# Altium schematic sheet laser.SchDoc: Laser
size A4; Author: Peter Tanner; SheetNumber: 6; SheetTotal: 9; SPICEModelCacheEYCFJCLC: <root> / <DocumentId>EYCFJCLC</DocumentId> / <CacheFrame Number="0"> / <Model Name="si2302cds" Kind="CKT"> / <Text>*August 11, 2008 / *Doc. ID: 68508, S-81826, Rev. A / *File Name: Si2302CDS_PS.txt and Si2302CDS_PS.lib / *This document is intended as a SPICE modeling guideline and does not / *constitute a commercial product data sheet.  Designers should refer to the / *appropriate data sheet of the same number for guaranteed specification / *limits. / .SUBCKT Si2302CDS D G S / M1  3  GX S S NMOS W=273327u L=0.250u / M2  S  GX S D PMOS W=273327u L=0.235u / RG  G  GX     4 / R1  D  3      RTEMP 18E-3 / CGS GX S      201E-12 / DBD S  D      DBD / *********************************************************** / .MODEL  NMOS       NMOS ( LEVEL  = 3        TOX    = 1.7E-8 / + RS     = 18E-3          RD     = 0        NSUB   = 2.45E17 / + KP     = 2.8E-5         UO     = 650 / + VMAX   = 0              XJ     = 5E-7     KAPPA  = 3E-2 / + ETA    = 1E-4           TPG    = 1 / + IS     = 0              LD     = 0 / + CGSO   = 0              CGDO   = 0        CGBO   = 0 / + NFS    = 0.8E12         DELTA  = 0.1) / ************************************************************ / .MODEL  PMOS       PMOS ( LEVEL  = 3        TOX    = 1.7E-8 / +NSUB    = 2E17           IS     = 0        TPG    = -1) / ************************************************************ / .MODEL DBD D (CJO=60E-12 VJ=0.38 M=0.26 / +FC=0.5 TT=4.71E-8 T_MEASURED=25 BV=21 / +RS=4.856e-02 N=1.214 IS=5.289e-09 IKF=1000 / +EG=5.600e-01 XTI=8.258 TRS1=2.944e-12) / ************************************************************ / .MODEL RTEMP RES (TC1=8E-3 TC2=5.5E-6) / ************************************************************ / .ENDS</Text> / </Model> / <Model Name="di_1n5819" Kind="MDL"> / <Text>*SRC=1N5819;DI_1N5819;Diodes;Si;  40.0V  1.00A  3.00us   Diodes Inc. Schottky Barrier Rectifier / .MODEL DI_1N5819 D  ( IS=390n RS=0.115 BV=40.0 IBV=1.00m / + CJO=203p  M=0.333 N=1.70 TT=4.32u )</Text> / </Model> / </CacheFrame> / </root>
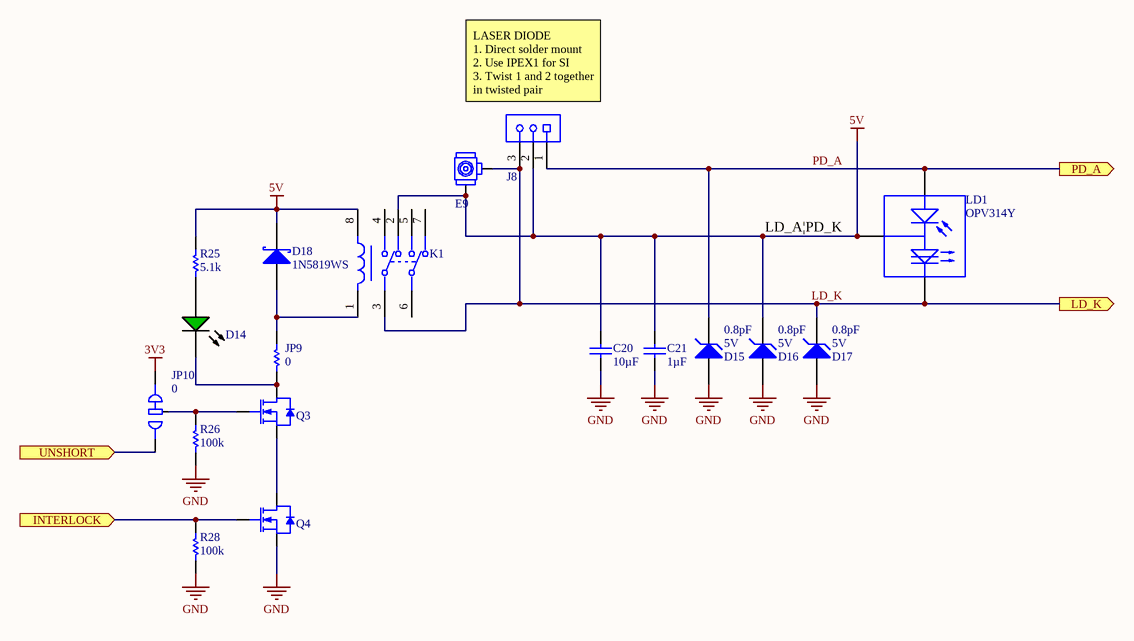
[diagram p0: laser.SchDoc]

## Parts
C20  value 10µF  [CAPC1005X06N]  (hidden comment: CL05A106MQ5NUNC)
C21  value 1µF  [CAPC1005X06N]  (hidden comment: CL05A105KA5NQNC)
D14  KT-0805G  [LED_0805]  (value not drawn)
D15  value 5V  Capacitance: 0.8pF  [DFN60P100X45-2L]  (hidden comment: H5VU10U)
D16  value 5V  Capacitance: 0.8pF  [DFN60P100X45-2L]  (hidden comment: H5VU10U)
D17  value 5V  Capacitance: 0.8pF  [DFN60P100X45-2L]  (hidden comment: H5VU10U)
D18  1N5819WS  [SODFL250X100-2N]
E9  U.FL-R-SMT-1(01)  [HRS-U.FL-R-SMT-3_V 4_LAYER_KO]  (value not drawn)
J8  B3B-PH-K-S(LF)(SN)  [JST-B3B-PH-K-S-3_V]  (value not drawn)
JP9  value 0  [RESC1005X04N]  (hidden comment: 0402WGF0000TCE)
JP10  value 0  [RESC1005X04N TWO STATE]  (hidden comment: JUMPER-0402 TWO STATE)
K1  AGQ200A4HX  [FP-AGQ200S03Z-MFG]  (value not drawn)
LD1  OPV314Y  [TO-18]
Q3  MDD2302  [SOT95P252X140-3N]  (value not drawn)
Q4  MDD2302  [SOT95P252X140-3N]  (value not drawn)
R25  value 5.1k  [RESC1005X04N]  (hidden comment: 0402WGF5101TCE)
R26  value 100k  [RESC1005X04N]  (hidden comment: CRCW0402100KFKEDC)
R28  value 100k  [RESC1005X04N]  (hidden comment: CRCW0402100KFKEDC)

## Ports
INTERLOCK (in), LD_K (out), PD_A (out), UNSHORT (in)

## Nets
3V3: JP10.2
5V: C20.2 C21.2 D16.1(K) D18.1(K) E9.2(GND) J8.2 K1.2 K1.8 LD1.2(COM) R25.2
GND: C20.1 C21.1 D15.2(A) D16.2(A) D17.2(A) Q4.2(S) R26.1 R28.1
INTERLOCK: Q4.1(G) R28.2 ; port INTERLOCK
LD_K: D17.1(K) E9.1(SIG) J8.3 K1.3 LD1.1(LD_K) ; port LD_K
PD_A: D15.1(K) J8.1 LD1.3(PD_A) ; port PD_A
UNSHORT: JP10.1 ; port UNSHORT
NetD14_1: D14.1(K) JP9.1 Q3.3(D)
NetD14_2: D14.2(A) R25.1
NetD18_2: D18.2(A) JP9.2 K1.1
NetJP10_3: JP10.3(COM) Q3.1(G) R26.2
NetQ3_2: Q3.2(S) Q4.3(D)

Not connected (* = marked no-connect by the designer): K1 4 5 6 7

## Notes on the sheet
- (near J8) LASER DIODE
  1. Direct solder mount
  2. Use IPEX1 for SI
  3. Twist 1 and 2 together in twisted pair
- (near LD1) LD_A|PD_K
- Title:
- Designer:
- Date:
- Size:
- Revision:
- A4
- Sheet:
- 35 Stirling Hwy, Perth WA 6009, Australia

## Library data of the parts
C20 = CMP-00663-2: Cap Ceramic 10uF 6.3V X5R 20% SMD 0402 85°C Paper T/R; Source: JLCPCB(Basic); JLC_PN: C15525; Tolerance: 20%; Case Code (Imperial): 0402; Voltage Rating: 6.3V; RoHS Compliant: Yes; Dielectric: X5R
C21 = CMP-00190-9: Ceramic Capacitor, Multilayer, Ceramic, 25V, 10% +Tol, 10% -Tol, X5R, 15% TC, 1uF, Surface Mount, 0402; JLC_PN: C52923; RoHS Compliant: Yes; Source: JLCPCB(Basic); Voltage Rating: 25V; Case Code (Imperial): 0402; Dielectric: X5R; Tolerance: 10%
D14 = CMP-00712-3: Emerald 0805  Light Emitting Diodes (LED) ROHS green; Forward Voltage: 2.8V; Wavelength: 520nm; Color: Emerald; Source: JLCPCB(Basic); JLC_PN: C2297; Case Code (Imperial): 0805; RoHS Compliant: Unsure
D15-D17 = CMP-00841-4: 5A 55W 16V 9V Unidirectional 5V DFN1006-2L  ESD and Surge Protection (TVS/ESD) ROHS; Breakdown Voltage: 9V; Source: JLCPCB(Basic); JLC_PN: C22395519; Polarity: Unidirectional; RoHS Compliant: Unsure; Package: DFN1006-2L; Peak Pulse Power Dissipation: 55W; Clamping Voltage: 16V
D18 = CMP-00680-5: VR=40V IF=1A 120pF P=250mW; Forward Voltage: 600mV; Forward Current: 1A; Max Reverse Current: 500µA; Max Repetitive Reverse Voltage (Vrrm): 40V; Power Dissipation: 1.5W; Max Forward Surge Current (Ifsm): 25A; Technology: SCHOTTKY; Case/Package: SOD-323; JLC_PN: C191023; RoHS Compliant: Unsure; Source: JLCPCB(Basic)
E9 = CMP-00380-18: Rf Connectors / Coaxial Connectors SMT Ml Rec Au 50 Ohm W/anti Sldr Wicking UFL; Number of Ports: 1; Dielectric Material: Polymer; Impedance: 50; Mating Cycles: 30; Connector Type: Receptacle,Male Pin; Body Plating: Silver; Center Contact Plating: Gold; Max Frequency: 6GHz; Body Material: Bronze; Lead Free: Lead Free; Series: U.FL; JLC PN: C88374; Contact Material: Brass; Fastening Type: SNAP-ON; Min Operating Temperature: -40°C; RoHS Compliant: Yes; Housing Color: Beige; Depth: 3mm; Contact Plating: Gold; Mount: Surface Mount; Length: 3.1mm; Orientation: Vertical; Termination: Solder; Max Operating Temperature: 90°C; Source: UWAA_Stock
J8 = CMP-00693-1: Connector Header, PH Series, 3 Position, 2.00mm, Through Hole, Press-Fit, Solder, Natural; Mated Stacking Heights: 8mm; Voltage Rating (DC): 100V; Contact Post Length: 0.134inch; Gender: Male; Number of Positions: 3; Contact Type: Male Pin; Max Operating Temperature: 85°C; Packaging: Bulk; Insulation Height: 0.236inch; Min Operating Temperature: -25°C; Termination: Press-Fit; Material: Polyamide; Voltage Rating: 100V; Number of Rows: 1; Contact Material: Brass; Contact Shape: Square; Insulation Color: Natural; Weight: 28.349523g; Flammability Rating: UL94 V-0; Insulation Material: Nylon; Fastening Type: Detent; Series: PH; Contact Finish - Mating: TIN; Contact Mating Length: 0.13inch; Lead Free: Lead Free; Connector Type: Header; Mounting Technology: Through Hole
JP9 = CMP-00817-3: Metal Glaze/thick Film, 0.0625W, 0ohm, 0402; Tolerance: 1%; Source: JLCPCB(Basic); Case Code (Imperial): 0402; RoHS Compliant: Unsure; JLC_PN: C17168
JP10 = CMP-009-00003-3: JUMPER-0402 TWO STATE Fixed Resistor, Metal Glaze/thick Film, 0.1W, 0ohm, Surface Mount, 0402; Tolerance: 1%; Power Rating: 100mW; Source: JLCPCB(Basic); JLC_PN: C17168; Case Code (Imperial): 0402; RoHS Compliant: Yes
K1 = CMP-008-00000-1: Electromechanical Relay 4.5VDC 145Ohm 2A DPDT (10.6x8.4x5.4)mm SMD General Purpose Relay; Contact Voltage Rating (AC): 125V; Sealable: WATER PROOF; Electrical Life: 100kcycles; Contact Resistance: 100mΩ; Release Time: 4ms; Coil Power: 140mW; Coil Current: 31mA; Number of Contacts: 2; Coil Voltage (DC): 3.375V; Coil Type: Non-Latching; Insulation Resistance: 1GΩ; Voltage Rating: 110V; Coil Resistance: 145Ω; Relay Type: Telecom; Depth: 8.4mm; Number of Pins: 8; Voltage Rating (AC): 125V; Current Rating: 2A; Height: 5.4mm; Contact Material: Gold, Silver; Max Voltage Rating (AC): 125V; Switching Current: 2A; Mount: Surface Mount; Contact Current Rating: 2A; Operate Time: 4ms; Number of Terminals: 8; Termination: Gull Wing; Response Time: 4ms; Contact Plating: Gold; Source: Distributor; Max Voltage Rating (DC): 110V; RoHS: Compliant; Length: 10.6mm; Throw Configuration: DPDT; Power Consumption: 140mW
LD1 = CMP-00026-00000-4: VCSEL Emitter, 840nm Min, 860nm Max, 2500Mbps, TO-46, Through Hole Mount; Max Supply Voltage: 2.2V; Supply Current: 15mA; Body Height: 3.66mm; Operating Wavelength-Nom: 850nm; Threshold Current-Min: 3mA; Body Length or Diameter: 4.67mm; Transmission Type: Digital; Fall Time-Max: 0.1ns; Min Supply Voltage: 1.6V; Spectral Width: 0.85nm; Built-in Feature: MONITOR PHOTODIODE; Number of Channels: 1; Min Operating Temperature: 0°C; Max Operating Temperature: 70°C; Data Rate: 2500Mbps; Package Style: TO-46Meter; RoHS Compliant: Yes; Reach SVHC Compliant: Yes; Operating Wavelength-Max: 860nm; Mounting Technology: Through Hole; Operating Wavelength-Min: 840nm; Fiber Optic Device Type: VCSEL EMITTER; Rise Time: 0.1ns
Q3 Q4 = CMP-00703-4: 4A 25mΩ@4.5V null SOT-23 MOSFETs ROHS N CHANNEL; Max Power Dissipation: 1.25W; Input Capacitance: 340pF; Gate to Source Voltage (Vgs): 12V; Drain to Source Voltage (Vdss): 20V; Threshold Voltage: 1.2V; Rds On Max: 28m; RoHS Compliant: Unsure; Source: JLCPCB(Basic); Type: N channel; JLC_PN: C427390; Continuous Drain Current (ID): 4A; Case/Package: SOT-23
R25 = CMP-00657-3: RESISTOR, 0402 1% 5K1; Power Rating: 0.0625W; Resistance: 5.1kohm; Tolerance, Resistance: ± 1%; Series: MC;...; RoHS Compliant: Unsure; JLC_PN: C25905; Source: JLCPCB(Basic); Tolerance: 1%; Case Code (Imperial): 0402
R26 R28 = CMP-00094-5: RES 100K OHM 1% 1/16W 0402; Power Rating: 62.5mW; Temperature Coefficient: 100ppm/°C; Tolerance: 1%; Case Code (Imperial): 0402; Source: JLCPCB(Basic); JLC_PN: C25741; RoHS Compliant: Unsure